# Altium project NE555.PrjPcb
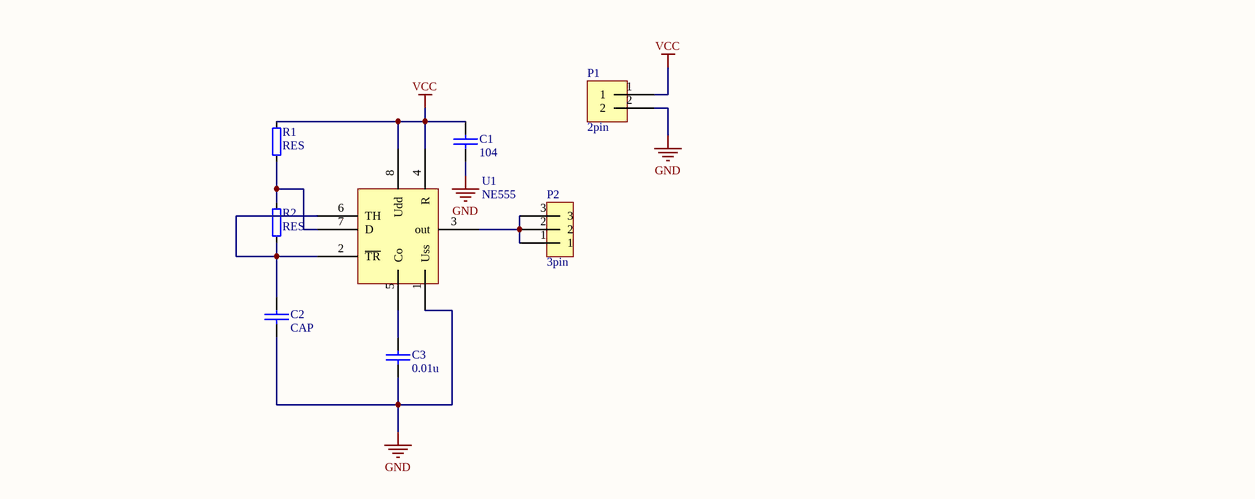
[diagram p0: NE555DXZD.SchDoc]
2 sheets, 16 parts. Net scope: global (net labels, ports and power ports of the same name join across sheets).
Board files: NE555DXZD.PcbDoc, NE555DWTZD.PcbDoc
Sheets:
  NE555DXZD.SchDoc
  NE555DWTZD.SchDoc

## Sheet NE555DXZD.SchDoc
size A4

### Parts
C1  104  [RAD0.1]
C2  CAP  [RAD0.1]
C3  0.01u  [RAD0.1]
P1  2pin  [2pin针]
P2  3pin  [3PIN排针]
R1  RES  [AXIAL0.4]
R2  RES  [AXIAL0.4]
U1  NE555  [8pin座]

### Nets
GND: C1.2 C2.2 C3.2 P1.2 U1.1(Uss)
VCC: C1.1 P1.1 R1.2 U1.4(R) U1.8(Udd)
NetC2_1: C2.1 R2.1 U1.2(~{TR}) U1.6(TH)
NetC3_1: C3.1 U1.5(Co)
NetP2_1: P2.1 P2.2 P2.3 U1.3(out)
NetR1_1: R1.1 R2.2 U1.7(D)

### Library data of the parts
C1 C3 = CAP

## Sheet NE555DWTZD.SchDoc
size A4
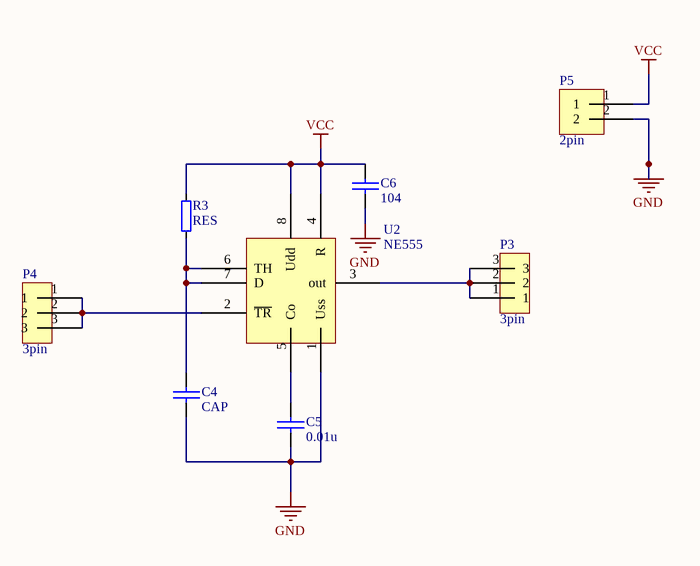
[diagram p1: NE555DWTZD.SchDoc]

### Parts
C4  CAP  [RAD0.1]
C5  0.01u  [RAD0.1]
C6  104  [RAD0.1]
P3  3pin  [3PIN排针]
P4  3pin  [3PIN排针]
P5  2pin  [2pin针]
R3  RES  [AXIAL0.4]
U2  NE555  [8pin座]

### Nets
GND: C4.2 C5.2 C6.2 P5.2 U2.1(Uss)
VCC: C6.1 P5.1 R3.2 U2.4(R) U2.8(Udd)
NetC4_1: C4.1 R3.1 U2.6(TH) U2.7(D)
NetC5_1: C5.1 U2.5(Co)
NetP3_1: P3.1 P3.2 P3.3 U2.3(out)
NetP4_1: P4.1 P4.2 P4.3 U2.2(~{TR})

### Library data of the parts
C5 C6 = CAP

## Nets that join several sheets
GND: NE555DXZD (5 pins), NE555DWTZD (5 pins)
VCC: NE555DXZD (5 pins), NE555DWTZD (5 pins)